# Altium schematic sheet Hardware.SchDoc
size Letter; SheetNumber: 5; SheetTotal: 5
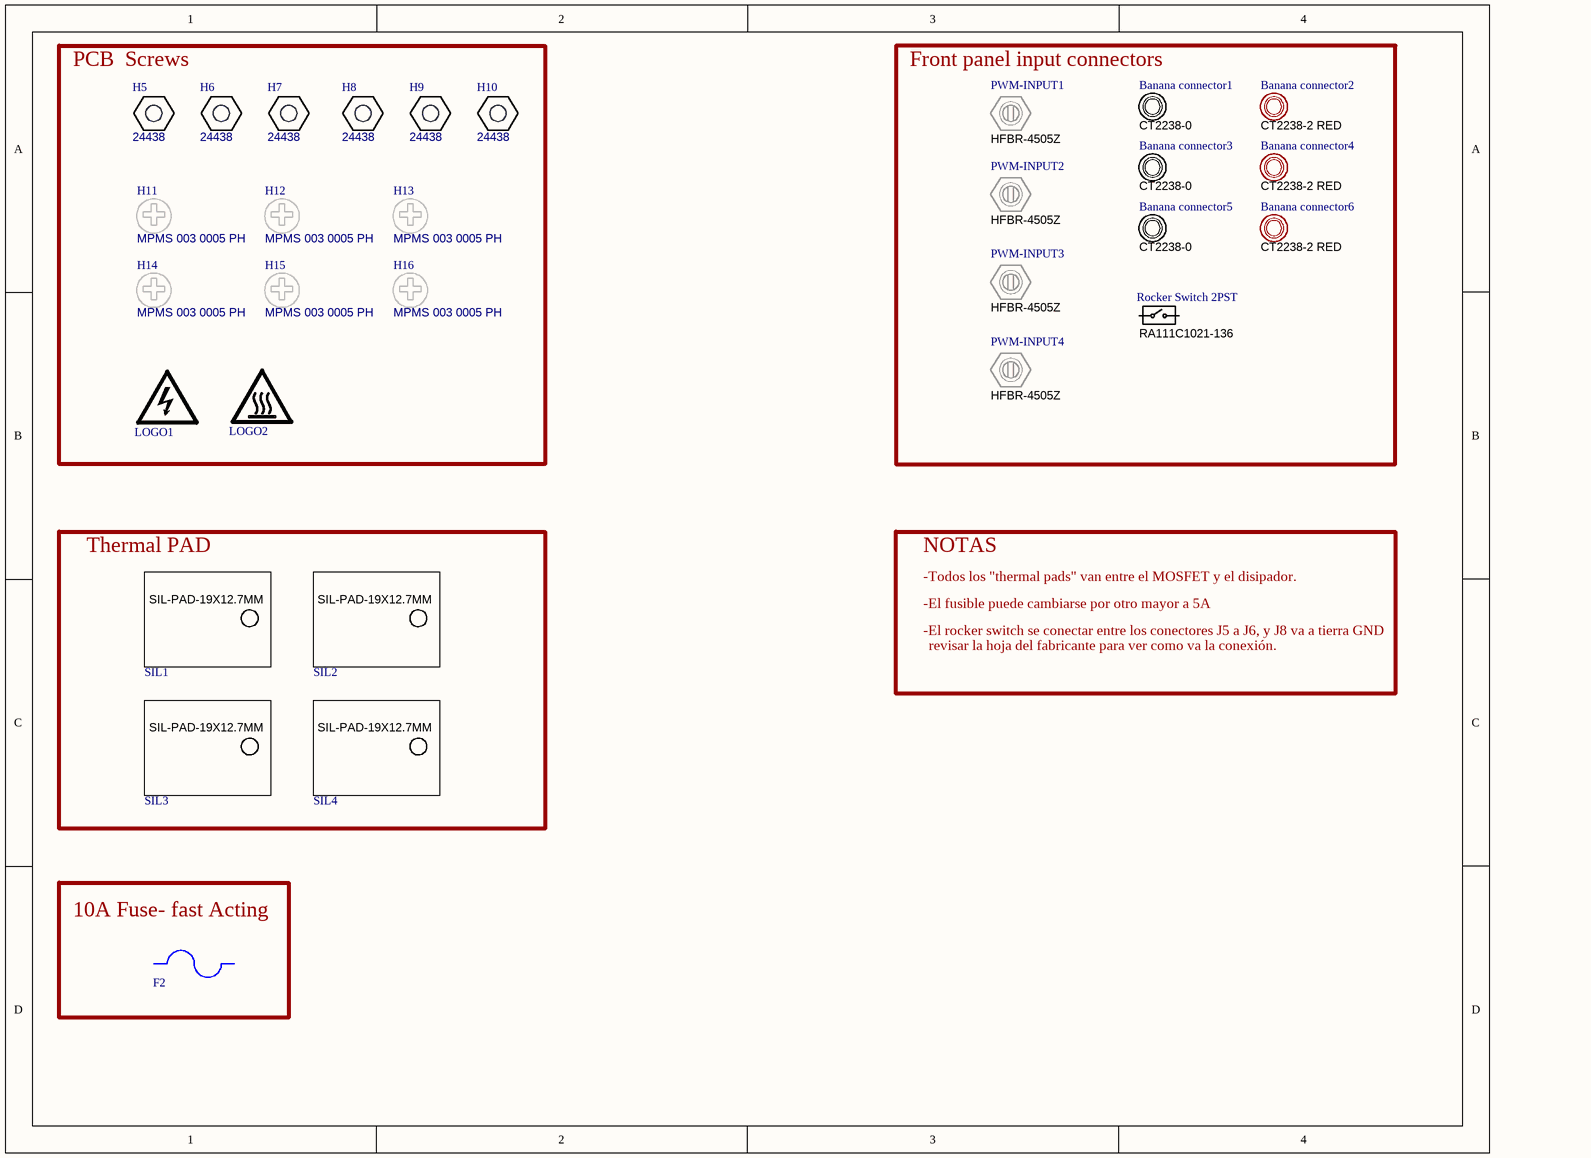
[diagram p0: Hardware.SchDoc]

## Parts
Banana_connector1  CT2238-0  (mechanical)
Banana_connector2  CT2238-2 RED  (mechanical)
Banana_connector3  CT2238-0  (mechanical)
Banana_connector4  CT2238-2 RED  (mechanical)
Banana_connector5  CT2238-0  (mechanical)
Banana_connector6  CT2238-2 RED  (mechanical)
F2  5SF 10-R  (value not drawn)  (mechanical)
H5  24438  [Keystone24438]
H6  24438  [Keystone24438]
H7  24438  [Keystone24438]
H8  24438  [Keystone24438]
H9  24438  [Keystone24438]
H10  24438  [Keystone24438]
H11  MPMS 003 0005 PH  [BuildingFastener_MPMS_003_0005_PH]
H12  MPMS 003 0005 PH  [BuildingFastener_MPMS_003_0005_PH]
H13  MPMS 003 0005 PH  [BuildingFastener_MPMS_003_0005_PH]
H14  MPMS 003 0005 PH  [BuildingFastener_MPMS_003_0005_PH]
H15  MPMS 003 0005 PH  [BuildingFastener_MPMS_003_0005_PH]
H16  MPMS 003 0005 PH  [BuildingFastener_MPMS_003_0005_PH]
LOGO1  DANGER HIGH VOLTAGE  [IEC_HighVoltage_Medium]  (value not drawn)  (no BOM)
LOGO2  CAUTION HOT SURFACE  [IEC_HotSurface_Medium]  (value not drawn)  (no BOM)
PWM-INPUT1  HFBR-4505Z  (mechanical)
PWM-INPUT2  HFBR-4505Z  (mechanical)
PWM-INPUT3  HFBR-4505Z  (mechanical)
PWM-INPUT4  HFBR-4505Z  (mechanical)
Rocker_Switch_2PST  RA111C1021-136  (mechanical)
SIL1  SP900S-0.009-AC-58  [SIL-PAD_19x12.7mm]  (value not drawn)  (mechanical)
SIL2  SP900S-0.009-AC-58  [SIL-PAD_19x12.7mm]  (value not drawn)  (mechanical)
SIL3  SP900S-0.009-AC-58  [SIL-PAD_19x12.7mm]  (value not drawn)  (mechanical)
SIL4  SP900S-0.009-AC-58  [SIL-PAD_19x12.7mm]  (value not drawn)  (mechanical)

## Blocks framed on the sheet
PCB  Screws: H5-H16 LOGO1 LOGO2
Front panel input connectors: Banana_connector1-Banana_connector6 PWM-INPUT1-PWM-INPUT4 Rocker_Switch_2PST
Thermal PAD: SIL1-SIL4
10A Fuse- fast Acting: F2

## Notes on the sheet
- NOTAS
- -Todos los "thermal pads" van entre el MOSFET y el disipador.
- -El fusible puede cambiarse por otro mayor a 5A
- -El rocker switch se conectar entre los conectores J5 a J6, y J8 va a tierra GND
- revisar la hoja del fabricante para ver como va la conexión.
- (in symbol SP900S-0.009-AC-58) SIL-PAD-19X12.7MM

## Library data of the parts
Banana_connector1 Banana_connector3 Banana_connector5 = CT2238-0: Cable Assembly 4MM Safety Jack, Panel W/.25 Fast on Terminal Black; Manufacturer: Cal Test Electronics; Supplier 1: Digi-Key; Supplier Part Number 1: BKCT2238-0-ND; Manufacturer Part Number: CT2238-0; RoHS: No; Stock 1: 1448; Pricing 1: 1=2,00000 (USD)
Banana_connector2 Banana_connector4 Banana_connector6 = CT2238-2: Cable Assembly 4MM Safety Jack, Panel W/.25 Fast on Terminal Red; Manufacturer: Cal Test Electronics; Manufacturer Part Number: CT2238-0; Supplier 1: Digi-Key; Supplier Part Number 1: BKCT2238-0-ND; RoHS: No; Stock 1: 1448; Pricing 1: 1=2,00000 (USD)
F2 = 5SF 10-R: Fuse, 10 A, 250 VAC, N/A; Manufacturer: Bel Fuse; SymbolCreator: a0412235; VAC_V: 250; Interrupt_AC: 100; Irating_A: 10; Rtyp_Ohm: 0.006; MeltingTyp: 163; SymbolVersion: 2013-06-05; PartNumber: 5SF 10-R; MountType: N/A; CompType: Fuse; RoHS: Y; Published: 2009-03-05; Publisher: Texas Instruments; LatestRevisionDate: 2016-05-23; ComponentLink1Description: Datasheet URL; ComponentLink1URL: http://belfuse.com/pdfs/5SF.pdf; Supplier 1: Digi-Key; Supplier Part Number 1: 507-1235-ND; Supplier 2: Mouser; Supplier Part Number 2: 530-5SF10-R
H5-H10 = CMP-0003640-1: Standoff, Hex,25mm Length, M3, Aluminum; Manufacturer: Keystone; CompType: Hardware; ComponentLink1URL: http://www.keyelco.com/userAssets/file/M60-2p72.pdf; Key: 24438; Publisher: Texas Instruments; Supplier Part Number 2: 534-24438; Supplier 1: Digi-Key; PackageReference: Standoff M3; LatestRevisionDate: 2017-03-09; RoHS: Y; Supplier Part Number 1: 36-24438-ND; MountType: TH; Supplier 2: Mouser; PartNumber: 24438; ComponentLink1Description: Datasheet Link
H11-H16 = CMP-0003646-1: MACHINE SCREW PAN PHILLIPS M3 5mm; Manufacturer: B&F Fastener Supply; CompType: Hardware; ComponentLink1URL: http://www.fasnetdirect.com/refguide/MetD7985a.pdf; Key: MPMS 003 0005 PH; Publisher: Texas Instruments; PackageReference: Screw M3 Phillips head; LatestRevisionDate: 2017-03-09; ClassName: Screw; RoHS: Y; MountType: N/A; PartNumber: MPMS 003 0005 PH; ComponentLink1Description: Datasheet Link; Supplier 1: Digi-Key; Supplier Part Number 1: H742-ND
LOGO1 = CMP-0074835-1: IEC 61010-1 High Voltage Warning; SymbolCreator: a0412235; Lib Reference: IEC_HighVoltage; SymbolVersion: 2011-08-22; Published: 2009-03-03; Publisher: Texas Instruments; LatestRevisionDate: 2017-07-06; PartNumber: DANGER HIGH VOLTAGE; Library Reference: IEC_HighVoltage
LOGO2 = CMP-0074837-1: IEC 61010-1 Hot Surface Warning; SymbolCreator: a0412235; Lib Reference: IEC_HotSurface; SymbolVersion: 2011-08-22; Published: 2009-03-03; Publisher: Texas Instruments; LatestRevisionDate: 2017-07-06; PartNumber: CAUTION HOT SURFACE; Library Reference: IEC_HotSurface
PWM-INPUT1-PWM-INPUT4 = HFBR-4505Z: Conn POF Adapter Simplex F/F ST Panel Mount; Manufacturer: Broadcom Avago; Body Material: Plastic; Simplex/Duplex: Duplex; Gender: Male; Mode: Singlemode; Supplier 1: Digi-Key; Supplier Part Number 1: 516-1748-ND; Manufacturer Part Number: HFBR-4505Z; RoHS: Yes; Category: Fiber Optics; Stock 1: 6533; Pricing 1: 1=1,88000, 10=1,19200, 100=0,88240, 500=0,81090, 1000=0,66780, 2000=0,63441, 5000=0,63000 (USD); Mount: Panel,Bulkhead; Color: Grey; Housing Color: Grey; Material: Plastic; Housing Material: Plastic; Min Operating Temperature: -40°C; Max Operating Temperature: 85°C; Package Quantity: 500; Packaging: Bulk; Orientation: Straight; Series: -; Port Type: SIMPLEX; Length: 30mm; Depth: 11mm; REACH SVHC: No SVHC; Lead Free: Lead Free; RoHS Compliant: Yes
Rocker_Switch_2PST = RA111C1021-136: Illuminated Rocker Switches 16A 125VAC 4.8mm Tab Off-On; Manufacturer: E-Switch; Illumination Type: LED,Neon; Illumination Color: Green; Voltage Rating (AC): 125V; Throw Configuration: SPST; Electrical Life: 10000Cycles; Switch Function: On-Off; Supplier 1: Digi-Key; Supplier Part Number 1: RA111C1021-136-ND; Manufacturer Part Number: RA111C1021-136; RoHS: Yes; Category: Rocker Switches; Stock 1: 790; Pricing 1: 1=1,18000, 10=1,05800, 25=1,00160, 50=0,95480, 100=0,90790, 250=0,87048, 500=0,81900, 1000=0,77220 (USD); Mount: Panel,Snap in; Color: Black; Contact Plating: Silver; Housing Material: Polyamide; Min Operating Temperature: -20°C; Max Operating Temperature: 55°C; Package Quantity: 1; Current Rating: 16A; Packaging: Bulk; Termination: Quick Connect; Series: RA1, LAMB; RoHS Compliant: Yes; ComponentLink1URL: https://datasheet.ciiva.com/6470/ra1-6470604.pdf?src-supplier=Digi-Key; ComponentLink1Description: https://datasheet.ciiva.com/6470/ra1-6470604.pdf?src-supplier=Digi-Key
SIL1-SIL4 = SP900S-0.009-AC-58: Silcon Thermal Pad; Manufacturer: Bergquist Company; SymbolCreator: a0411947; SymbolVersion: 2016-05-23; ClassName: Thermal; CompType: Thermal Pad; PartNumber: SP900S-0.009-AC-58; RoHS: Y; PackageReference: 19x12.7 mm; MountType: N/A; ComponentLink1Description: Datasheet Link; ComponentLink1URL: http://www.bergquistcompany.com/pdfs/dataSheets/PDS_QP_3_12.08_E.pdf; Publisher: Texas Instruments; LatestRevisionDate: 2016-05-23; Supplier 1: Digi-Key; Supplier Part Number 1: BER183-ND; Supplier 2: Mouser; Supplier Part Number 2: 951-SP900S-009-AC-58